# EAGLE design Sample Tiny861 (EAGLE 7.1.0)
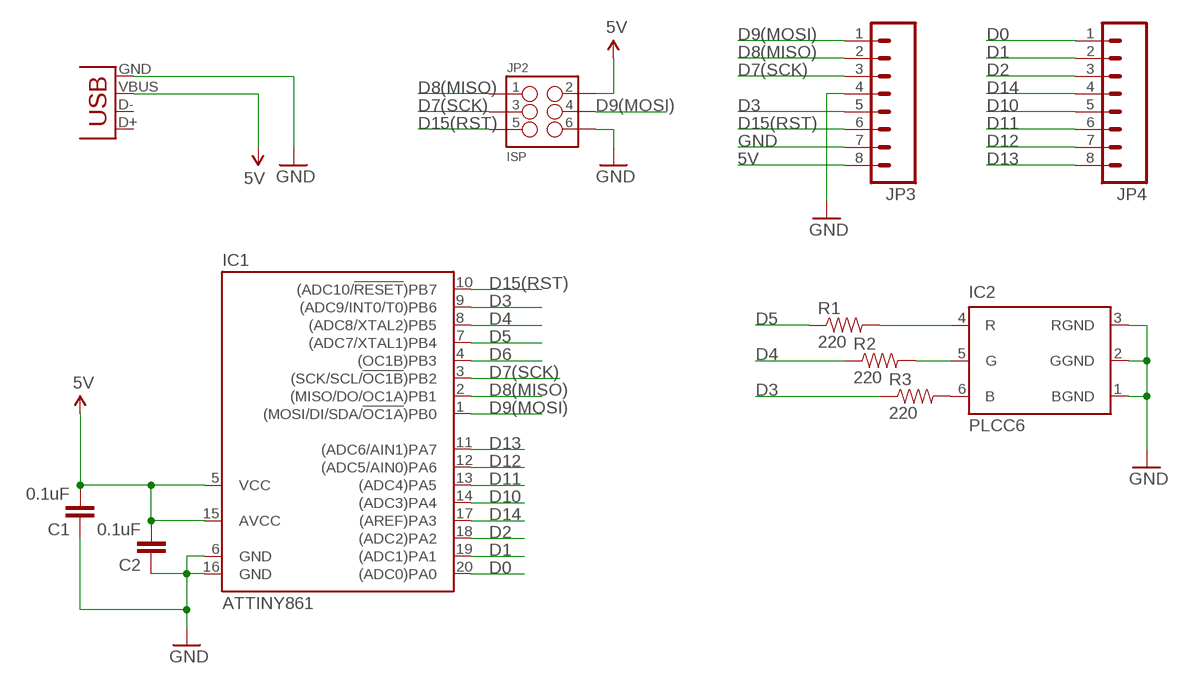
[diagram p0: schematic, sheet 1]

## Parts
C1  0.1uF  1.0UF-16V-10%(0603)  [0603-CAP]
C2  0.1uF  1.0UF-16V-10%(0603)  [0603-CAP]
IC1  ATTINY861  TINY26LS  [SO20L]
IC2  PLCC6  [PLCC6]
JP1  USBSMD  [USB-MINIB]
JP2  ISP  M03X22X3_SILK_SM  [2X3]
JP3  M08  [1X08_PIN1_NO_SILK]
JP4  M08  [1X08_PIN1_NO_SILK]
R1  220  RESISTOR0603  [0603-RES]
R2  220  RESISTOR0603  [0603-RES]
R3  220  RESISTOR0603  [0603-RES]

## Nets
5V: C1.2 C2.2 IC1.5(VCC) IC1.15(AVCC) JP1.VBUS JP2.2 JP3.8
D0: IC1.20((ADC0)PA0) JP4.1
D1: IC1.19((ADC1)PA1) JP4.2
D2: IC1.18((ADC2)PA2) JP4.3
D3: IC1.9((ADC9/INT0/T0)PB6) JP3.5 R3.1
D4: IC1.8((ADC8/XTAL2)PB5) R2.1
D5: IC1.7((ADC7/XTAL1)PB4) R1.1
D6: IC1.4((OC1B)PB3)
D7(SCK): IC1.3((SCK/SCL/!OC1B!)PB2) JP2.3 JP3.3
D8(MISO): IC1.2((MISO/DO/OC1A)PB1) JP2.1 JP3.2
D9(MOSI): IC1.1((MOSI/DI/SDA/!OC1A!)PB0) JP2.4 JP3.1
D10: IC1.14((ADC3)PA4) JP4.5
D11: IC1.13((ADC4)PA5) JP4.6
D12: IC1.12((ADC5/AIN0)PA6) JP4.7
D13: IC1.11((ADC6/AIN1)PA7) JP4.8
D14: IC1.17((AREF)PA3) JP4.4
D15(RST): IC1.10((ADC10/!RESET!)PB7) JP2.5 JP3.6
GND: C1.1 C2.1 IC1.6(GND) IC1.16(GND) IC2.1(BGND) IC2.2(GGND) IC2.3(RGND) JP1.GND JP2.6 JP3.4 JP3.7
N$2: IC2.4(R) R1.2
N$5: IC2.5(G) R2.2
N$6: IC2.6(B) R3.2
Unconnected: JP1.D+ JP1.D-

## Library data of the parts
C1 C2 = SparkFun-Capacitors:1.0UF-16V-10%(0603): CAP-00868; PROD_ID: CAP-00868; VALUE: 1.0uF
IC1 = atmel:TINY26*: 8-bit AVR Microcontroller with 2K Bytes Flash Source: http://www.atmel.com .. doc1477.pdf; MPN: ATTINY26L-8SU; OC_FARNELL: 9171665; OC_NEWARK: 01M6921
IC2 = Class Sample:PLCC6: QBLP679E-RGB LED
JP1 = SparkFun-Connectors:USB: USB Connectors USB-B-PTH is fully proven SKU : PRT-00139/CONN-08278 USB-miniB is fully proven SKU : PRT-00587 USB-A-PCB is untested. USB-A-H is throughly reviewed, but untested. Spark Fun Electronics SKU : PRT-00437 USB-B-SMT is throughly reviewed, but untested. Needs silkscreen touching up. USB-A-S has not been used/tested USB-MB-H has not been used/tested USB-MICROB has been used. CONN-09505; PROD_ID: CONN-08193
JP2 = SparkFun-Connectors:M03X2: 2x3 .1" header. Shrouded, with keying- CONN-10681 SMT- CONN-11415 Pogo pins- HW-11044
JP3 JP4 = SparkFun-Connectors:M08: Header 8 Standard 8-pin 0.1" header. Use with straight break away headers (SKU : PRT-00116), right angle break away headers (PRT-00553), swiss pins (PRT-00743), machine pins (PRT-00117), and female headers (PRT-00115).
R1-R3 = SparkFun-Resistors:RESISTOR: Resistor Basic schematic elements and footprints for 0603, 1206, and PTH resistors.

## Board
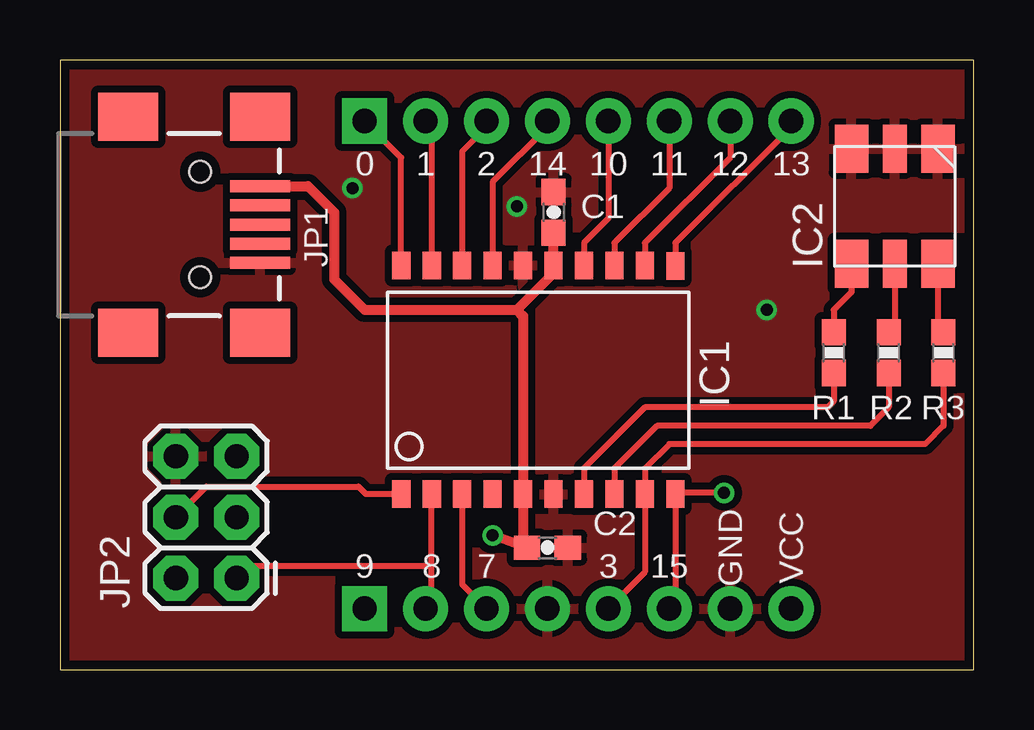
[diagram p1: board, top side]
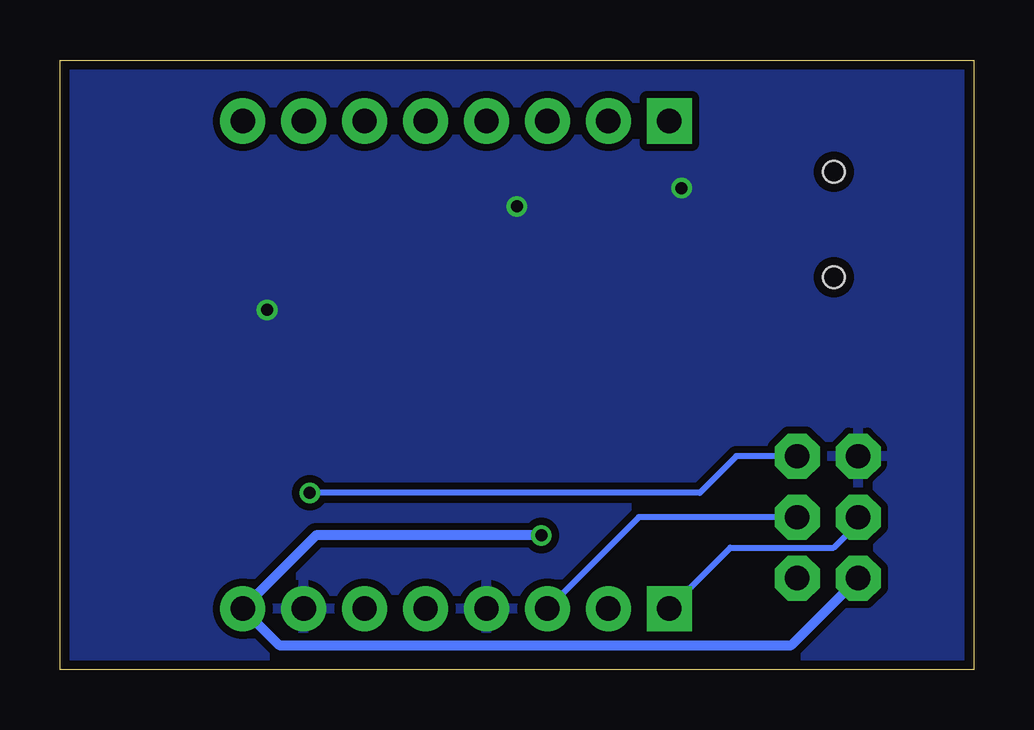
[diagram p2: board, bottom side, seen from below]

Size 38.1 x 25.4 mm. Coordinates in mm from the lower left corner, seen from the top.
Outline: 0,0 38.1,0 38.1,25.4 0,25.4 0,0
Copper layers (1*16): Top 0.0356mm / dielectric 1.5011mm / Bottom 0.0356mm
Design rules "LaenPCBOrder": minimum track width 6mil, minimum drill 13mil, track to track 6mil, track to pad 6mil, pad to pad 6mil, via to via 6mil, smd to smd 6mil, copper to edge 15mil, drill to drill 6mil, minimum pad ring 7mil, minimum via ring 7mil, stop-mask expansion 3mil, vias tented up to drill 0mil, thermal gap 10mil

### Footprints (pad centres in the part's own frame; a part is rotated, then mirrored left to right if it is on the bottom)
0603-CAP = smd 1.1 x 1: 1 -0.85,0; 2 0.85,0
SO20L = smd 0.762 x 1.143: 1 -5.08,-5.131; 2 -3.81,-5.131; 3 -2.54,-5.131; 4 -1.27,-5.131; 5 0,-5.131; 6 1.27,-5.131; 7 2.54,-5.131; 8 3.81,-5.131; 9 5.08,-5.131; 10 6.35,-5.131; 11 6.35,4.369; 12 5.08,4.394; 13 3.81,4.394; 14 2.54,4.394; 15 1.27,4.394; 16 0,4.394; 17 -1.27,4.394; 18 -2.54,4.394; 19 -3.81,4.394; 20 -5.08,4.394
PLCC6 = smd 2 x 1.4: 1 2.4,-1.8; 3 2.4,1.8; 4 -2.4,1.8; 6 -2.4,-1.8 | smd 2 x 1: 2 2.4,0; 5 -2.4,0
USB-MINIB = smd 2.5 x 0.5: D+ 2.5,0; D- 2.5,0.8; GND 2.5,-1.6; ID 2.5,-0.8; VBUS 2.5,1.6 | smd 2.5 x 2: MTN1 -3,4.5; MTN2 2.5,4.5; MTN3 -3,-4.5; MTN4 2.5,-4.5 | hole 0.9: 0,2.2; 0,-2.2
2X3 = drill 1.016 pad 1.88 octagon: 1 0,0; 2 0,2.54; 3 2.54,0; 4 2.54,2.54; 5 5.08,0; 6 5.08,2.54
1X08_PIN1_NO_SILK = drill 1.016 pad 1.88 square: 1 0,0 | drill 1.016 pad 1.88: 2 2.54,0; 3 5.08,0; 4 7.62,0; 5 10.16,0; 6 12.7,0; 7 15.24,0; 8 17.78,0
0603-RES = smd 1.1 x 1: 1 -0.85,0; 2 0.85,0

### Placement (x,y rotation side)
C1  20.57,19.05 270 top
C2  20.32,5.08 180 top
IC1  19.3,12.45 0 top
IC2  34.8,19.3 90 top
JP1  5.84,18.54 0 top
JP2  7.37,3.81 90 top
JP3  12.7,2.54 0 top
JP4  12.7,22.86 0 top
R1  32.26,13.21 90 top
R2  34.54,13.21 90 top
R3  36.83,13.21 90 top

### Tracks (layer width: path | path; a pad name or v marks a point on that pad's centre or on a via)
5V  (via drill 0.5)
  Top 0.406: C1.2 IC1.15 20.57,16.51 19.05,14.99 | JP1.VBUS 10.34,20.14 11.43,19.05 11.43,16.26 12.7,14.99 19.05,14.99 | v18.03,5.59 C2.2 19.3,5.17 IC1.5 19.3,14.73 19.05,14.99
  Bottom 0.406: JP2.2 7.62,1.02 28.96,1.02 JP3.8 27.43,5.59 v18.03,5.59
D0
  Top 0.254: JP4.1 14.22,21.34 IC1.20
D1
  Top 0.254: JP4.2 15.24,22.61 15.49,22.35 IC1.19
D2
  Top 0.254: JP4.3 17.78,22.61 16.76,21.59 IC1.18
D3
  Top 0.254: JP3.5 24.38,4.06 IC1.9 24.38,8.38 25.4,9.4 36.07,9.4 36.83,10.16 R3.1
D4
  Top 0.254: R2.1 34.54,10.92 33.78,10.16 24.89,10.16 23.11,8.38 IC1.8
D5
  Top 0.254: R1.1 32.26,11.18 32,10.92 24.38,10.92 21.84,8.38 IC1.7
D7(SCK)
  Top 0.254: IC1.3 16.76,3.56 JP3.3
  Bottom 0.254: JP2.3 13.97,6.35 JP3.3
D8(MISO)
  Top 0.254: JP3.2 15.49,2.79 15.49,4.32 | 15.49,4.32 IC1.2 | JP2.1 7.87,4.32 15.49,4.32
D9(MOSI)
  Top 0.254: IC1.1 12.75,7.32 12.45,7.62 6.1,7.62 JP2.4
  Bottom 0.254: JP3.1 10.16,5.08 5.84,5.08 4.83,6.1 JP2.4
D10
  Top 0.254: JP4.5 22.86,18.8 21.84,17.78 IC1.14
D11
  Top 0.254: JP4.6 25.4,20.07 23.11,17.78 IC1.13
D12
  Top 0.254: JP4.7 27.94,21.34 24.38,17.78 IC1.12
D13
  Top 0.254: JP4.8 30.48,22.61 25.65,17.78 IC1.11
D14
  Top 0.254: JP4.4 20.32,22.61 18.03,20.32 IC1.17
D15(RST)  (via drill 0.5)
  Top 0.254: JP3.6 25.65,2.79 IC1.10 25.7,7.37 v27.69,7.37
  Bottom 0.254: JP2.5 9.91,8.89 11.43,7.37 v27.69,7.37
GND  (via drill 0.5)
  other vias: 29.46,14.99 12.19,20.07 19.05,19.3
  pour Top (isolate 0.305): -0.51,25.91 38.35,25.91 38.35,-0.76 -0.51,-0.76
  pour Bottom (isolate 0.305): -1.02,26.67 38.86,26.67 38.86,-1.52 -1.02,-1.52
N$2
  Top 0.254: IC2.4 33,15.73 32.26,14.99 R1.2
N$5
  Top 0.254: IC2.5 34.8,14.31 R2.2
N$6
  Top 0.254: IC2.6 36.6,14.29 R3.2

### Text on the board
tNames: 0 | 1 | 2 | 14 | 10 | 11 | 12 | 13 | 9 | 8 | 7 | 3 | 15 | GND | VCC